# EAGLE schematic smoothieboard-0driver (EAGLE 6.4)

## Sheet 1 of 4
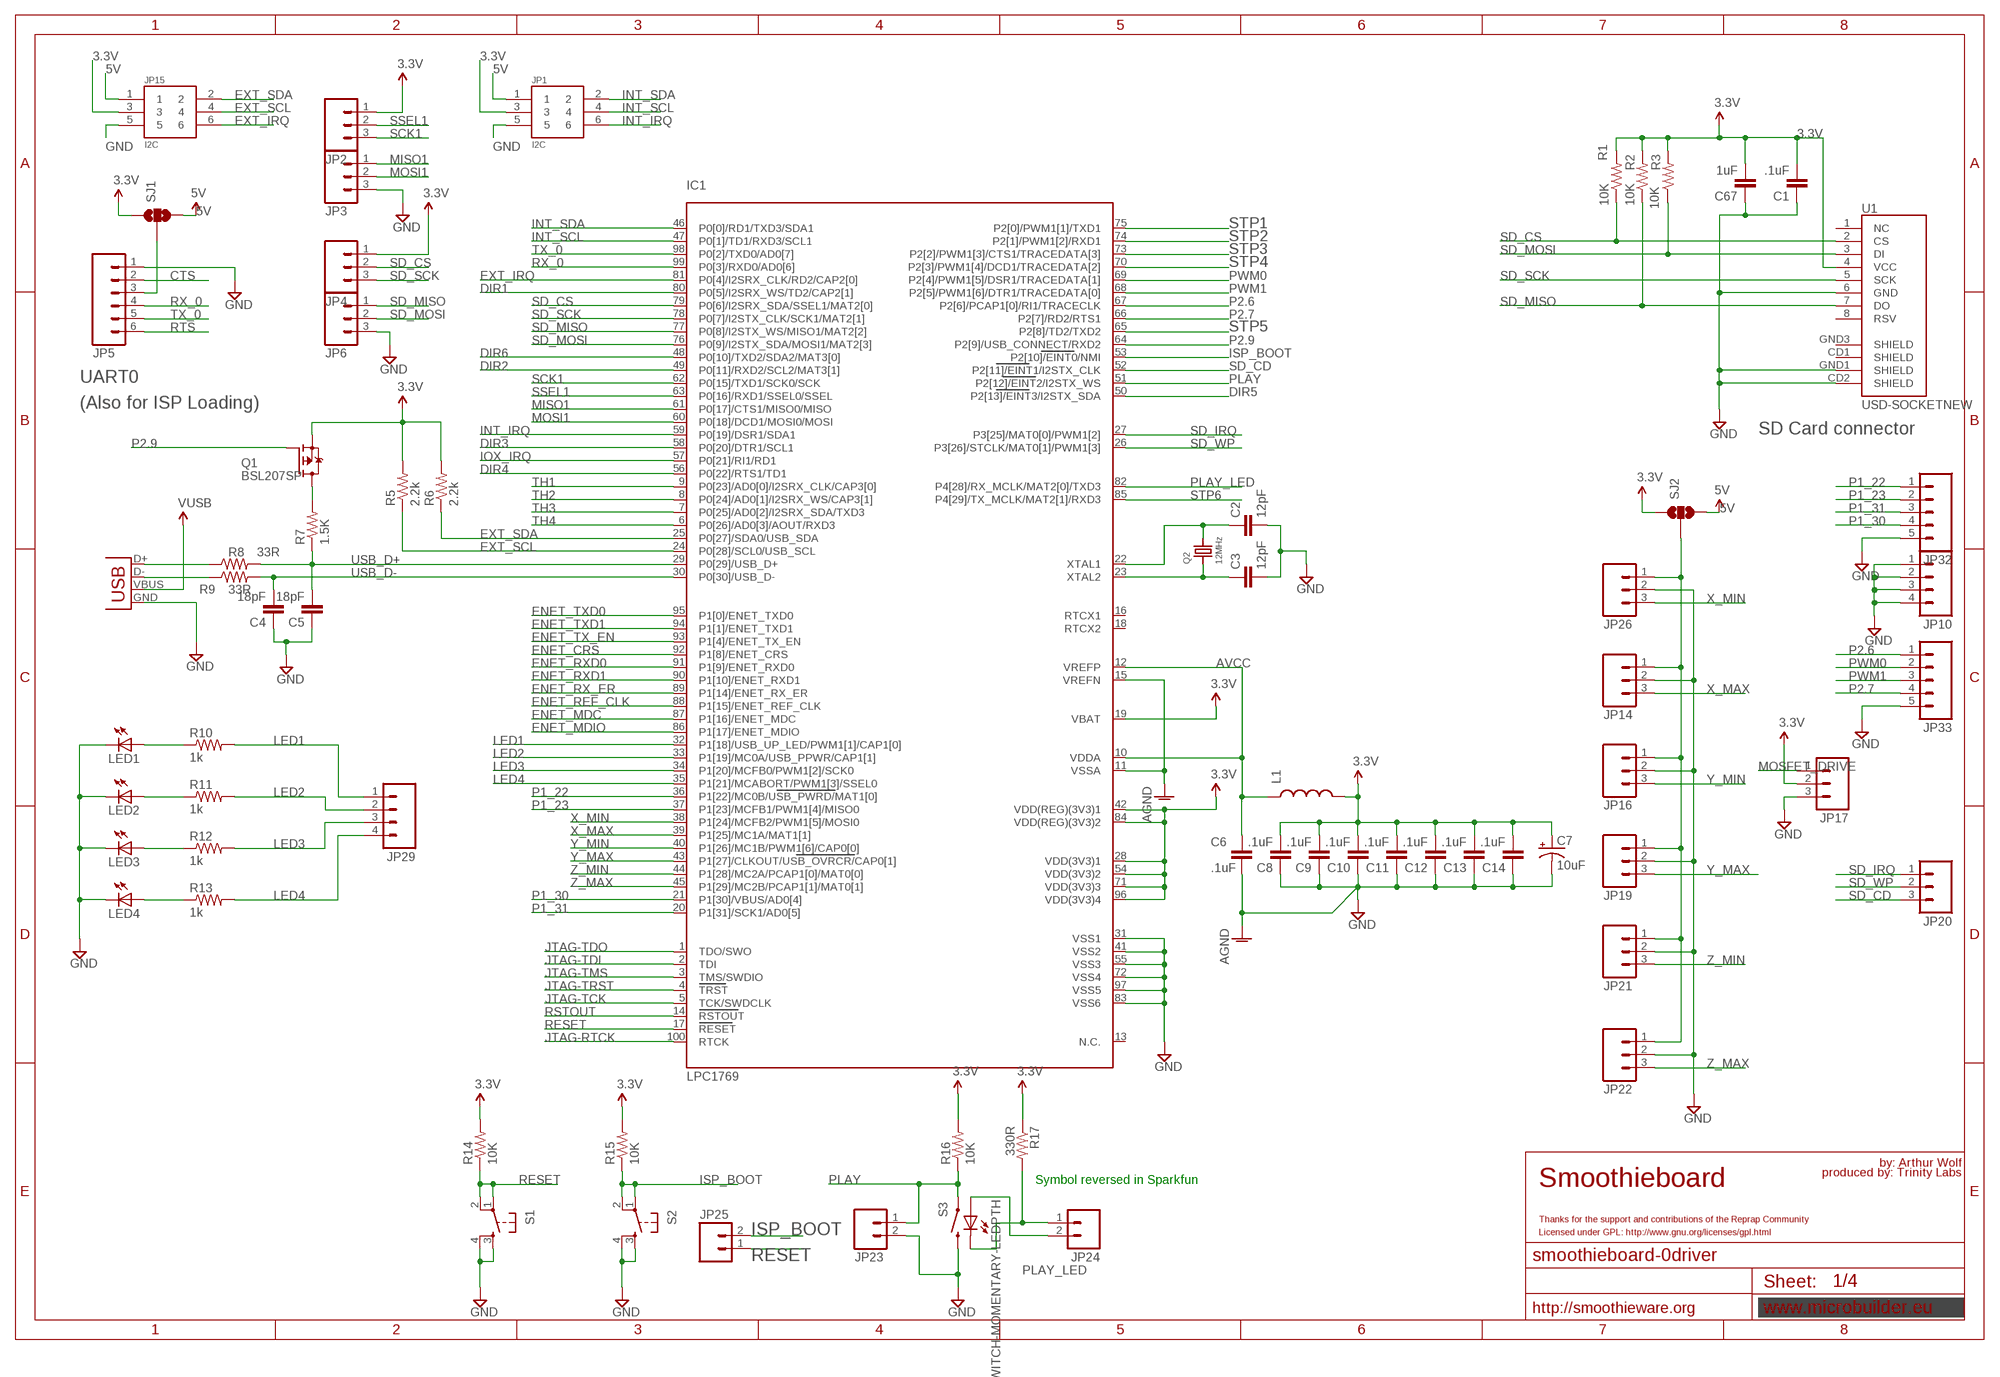
[diagram p0: schematic, sheet 1]

### Parts
C1  .1uF  C-EUC0603  [C0603]
C2  12pF  C-EUC0603  [C0603]
C3  12pF  C-EUC0603  [C0603]
C4  18pF  C-EUC0603  [C0603]
C5  18pF  C-EUC0603  [C0603]
C6  .1uF  C-EUC0603  [C0603]
C7  10uF  CAP_POL1206  [EIA3216]
C8  .1uF  C-EUC0603  [C0603]
C9  .1uF  C-EUC0603  [C0603]
C10  .1uF  C-EUC0603  [C0603]
C11  .1uF  C-EUC0603  [C0603]
C12  .1uF  C-EUC0603  [C0603]
C13  .1uF  C-EUC0603  [C0603]
C14  .1uF  C-EUC0603  [C0603]
C67  1uF  C-EUC0805  [C0805]
IC1  LPC1769  LPC1768  [LQFP100]
JP1  I2C  M03X2  [2X3-SHROUDED]
JP2  M031X03_NO_SILK  [1X03_NO_SILK]
JP3  M031X03_NO_SILK  [1X03_NO_SILK]
JP4  M031X03_NO_SILK  [1X03_NO_SILK]
JP5  M06POLAR  [MOLEX-1X6]
JP6  M031X03_NO_SILK  [1X03_NO_SILK]
JP10  M041X04_NO_SILK  [1X04_NO_SILK]
JP14  M03POLAR  [MOLEX-1X3]
JP15  I2C  M03X2  [2X3-SHROUDED]
JP16  M03POLAR  [MOLEX-1X3]
JP17  M03PTH  [1X03]
JP19  M03POLAR  [MOLEX-1X3]
JP20  M03PTH  [1X03]
JP21  M03POLAR  [MOLEX-1X3]
JP22  M03POLAR  [MOLEX-1X3]
JP23  M02PTH  [1X02]
JP24  M02PTH  [1X02]
JP25  M02PTH  [1X02]
JP26  M03POLAR  [MOLEX-1X3]
JP29  M041X04_NO_SILK  [1X04_NO_SILK]
JP32  M05PTH  [1X05]
JP33  M05PTH  [1X05]
L1  INDUCTOR0603  [0603]
LED1  LEDCHIP-LED0805  [CHIP-LED0805]
LED2  LEDCHIP-LED0805  [CHIP-LED0805]
LED3  LEDCHIP-LED0805  [CHIP-LED0805]
LED4  LEDCHIP-LED0805  [CHIP-LED0805]
Q1  BSL207SP  [SC74_INFINEON]
Q2  12MHz  CRYSTALTHIN  [CRYSTAL_3.2X2.5]
R1  10K  R-US_R0603  [R0603]
R2  10K  R-US_R0603  [R0603]
R3  10K  R-US_R0603  [R0603]
R5  2.2k  R-US_R0603  [R0603]
R6  2.2k  R-US_R0603  [R0603]
R7  1.5K  R-US_R0603  [R0603]
R8  33R  R-US_R0603  [R0603]
R9  33R  R-US_R0603  [R0603]
R10  1k  R-US_R0603  [R0603]
R11  1k  R-US_R0603  [R0603]
R12  1k  R-US_R0603  [R0603]
R13  1k  R-US_R0603  [R0603]
R14  10K  R-US_R0603  [R0603]
R15  10K  R-US_R0603  [R0603]
R16  10K  R-US_R0603  [R0603]
R17  330R  R-US_R0603  [R0603]
S1  TAC_SWITCHSMD  [TACTILE_SWITCH_SMD]
S2  TAC_SWITCHSMD  [TACTILE_SWITCH_SMD]
S3  SWITCH-MOMENTARY-LEDPTH  [TACTILE-PTH-LED-12MM]
SJ1  SOLDERJUMPER_2WAYS  [SJ_3]
SJ2  SOLDERJUMPER_2WAYS  [SJ_3]
U1  USD-SOCKETNEW  [MICRO-SD-SOCKET-PP]
X14  USBPTH  [USB-B-PTH]

### Nets
3.3V: C1.2 C7.A(+) C8.2 C9.2 C10.2 C11.2 C12.2 C13.2 C14.2 C67.2 IC1.19(VBAT) IC1.28(VDD(3V3)1) IC1.42(VDD(REG)(3V3)1) IC1.54(VDD(3V3)2) IC1.71(VDD(3V3)3) IC1.84(VDD(REG)(3V3)2) IC1.96(VDD(3V3)4) JP1.3 JP2.1 JP4.1 JP15.3 JP17.2 L1.2 Q1.4(S) R1.2 R2.2 R3.2 R5.2 R6.2 R14.2 R15.2 R16.2 R17.1 SJ1.1 SJ2.1 U1.4(VCC) ; also sheet 2,3
5V: JP1.1 JP15.1 SJ1.3 SJ2.3 ; also sheet 2,3,4
AGND: C6.2 IC1.11(VSSA) IC1.15(VREFN) ; also sheet 2
AVCC: C6.1 IC1.10(VDDA) IC1.12(VREFP) L1.1 ; also sheet 2
CTS: JP5.2
DIR1: IC1.80(P0[5]/I2SRX_WS/TD2/CAP2[1]) ; also sheet 2
DIR2: IC1.49(P0[11]/RXD2/SCL2/MAT3[1]) ; also sheet 2
DIR3: IC1.58(P0[20]/DTR1/SCL1) ; also sheet 2
DIR4: IC1.56(P0[22]/RTS1/TD1) ; also sheet 2
DIR5: IC1.50(P2[13]/EINT3/I2STX_SDA) ; also sheet 2
DIR6: IC1.48(P0[10]/TXD2/SDA2/MAT3[0]) ; also sheet 2
ENET_CRS: IC1.92(P1[8]/ENET_CRS) ; also sheet 3
ENET_MDC: IC1.87(P1[16]/ENET_MDC) ; also sheet 3
ENET_MDIO: IC1.86(P1[17]/ENET_MDIO) ; also sheet 3
ENET_REF_CLK: IC1.88(P1[15]/ENET_REF_CLK) ; also sheet 3
ENET_RX_ER: IC1.89(P1[14]/ENET_RX_ER) ; also sheet 3
ENET_RXD0: IC1.91(P1[9]/ENET_RXD0) ; also sheet 3
ENET_RXD1: IC1.90(P1[10]/ENET_RXD1) ; also sheet 3
ENET_TX_EN: IC1.93(P1[4]/ENET_TX_EN) ; also sheet 3
ENET_TXD0: IC1.95(P1[0]/ENET_TXD0) ; also sheet 3
ENET_TXD1: IC1.94(P1[1]/ENET_TXD1) ; also sheet 3
EXT_IRQ: IC1.81(P0[4]/I2SRX_CLK/RD2/CAP2[0]) JP15.6
EXT_SCL: IC1.24(P0[28]/SCL0/USB_SCL) JP15.4 R5.1
EXT_SDA: IC1.25(P0[27]/SDA0/USB_SDA) JP15.2 R6.1
GND: C1.1 C2.2 C3.2 C4.1 C5.1 C7.C(-) C8.1 C9.1 C10.1 C11.1 C12.1 C13.1 C14.1 C67.1 IC1.31(VSS1) IC1.41(VSS2) IC1.55(VSS3) IC1.72(VSS4) IC1.83(VSS6) IC1.97(VSS5) JP1.5 JP3.3 JP5.1 JP6.3 JP10.1 JP10.2 JP10.3 JP10.4 JP14.2 JP15.5 JP16.2 JP17.3 JP19.2 JP21.2 JP22.2 JP23.2 JP26.2 JP32.5 JP33.5 LED1.C LED2.C LED3.C LED4.C S1.3 S1.4 S2.3 S2.4 S3.2 U1.6(GND) U1.CD2(SHIELD) U1.GND1(SHIELD) X14.GND ; also sheet 2,3,4
INT_IRQ: IC1.59(P0[19]/DSR1/SDA1) JP1.6
INT_SCL: IC1.47(P0[1]/TD1/RXD3/SCL1) JP1.4 ; also sheet 2
INT_SDA: IC1.46(P0[0]/RD1/TXD3/SDA1) JP1.2 ; also sheet 2
IOX_IRQ: IC1.57(P0[21]/RI1/RD1) ; also sheet 2
ISP_BOOT: IC1.53(P2[10]/EINT0/NMI) JP25.2 R15.1 S2.1 S2.2
JTAG-RTCK: IC1.100(RTCK)
JTAG-TCK: IC1.5(TCK/SWDCLK)
JTAG-TDI: IC1.2(TDI)
JTAG-TDO: IC1.1(TDO/SWO)
JTAG-TMS: IC1.3(TMS/SWDIO)
JTAG-TRST: IC1.4(TRST)
LED1: IC1.32(P1[18]/USB_UP_LED/PWM1[1]/CAP1[0]) JP29.1 R10.2
LED2: IC1.33(P1[19]/MC0A/USB_PPWR/CAP1[1]) JP29.2 R11.2
LED3: IC1.34(P1[20]/MCFB0/PWM1[2]/SCK0) JP29.3 R12.2
LED4: IC1.35(P1[21]/MCABORT/PWM1[3]/SSEL0) JP29.4 R13.2
MISO1: IC1.61(P0[17]/CTS1/MISO0/MISO) JP3.1
MOSFET_DRIVE: JP17.1 ; also sheet 3,4
MOSI1: IC1.60(P0[18]/DCD1/MOSI0/MOSI) JP3.2
N$1: C2.1 IC1.22(XTAL1) Q2.2
N$2: C3.1 IC1.23(XTAL2) Q2.1
N$23: JP5.3 SJ1.2
N$51: Q1.1(D) Q1.2(D) Q1.5(D) Q1.6(D) R7.2
N$61: R8.1 X14.D+
N$62: R9.1 X14.D-
N$73: JP24.1 R17.2 S3.C
N$84: LED4.A R13.1
N$85: LED3.A R12.1
N$86: LED2.A R11.1
N$87: LED1.A R10.1
N$115: JP14.1 JP16.1 JP19.1 JP21.1 JP22.1 JP26.1 SJ2.2
P1_22: IC1.36(P1[22]/MC0B/USB_PWRD/MAT1[0]) JP32.1 ; also sheet 4
P1_23: IC1.37(P1[23]/MCFB1/PWM1[4]/MISO0) JP32.2 ; also sheet 4
P1_30: IC1.21(P1[30]/VBUS/AD0[4]) JP32.4
P1_31: IC1.20(P1[31]/SCK1/AD0[5]) JP32.3
P2.6: IC1.67(P2[6]/PCAP1[0]/RI1/TRACECLK) JP33.1 ; also sheet 3
P2.7: IC1.66(P2[7]/RD2/RTS1) JP33.4 ; also sheet 3
P2.9: IC1.64(P2[9]/USB_CONNECT/RXD2) Q1.3(G)
PLAY: IC1.51(P2[12]/EINT2/I2STX_WS) JP23.1 R16.1 S3.4
PLAY_LED: IC1.82(P4[28]/RX_MCLK/MAT2[0]/TXD3) JP24.2 S3.A
PWM0: IC1.69(P2[4]/PWM1[5]/DSR1/TRACEDATA[1]) JP33.2 ; also sheet 3
PWM1: IC1.68(P2[5]/PWM1[6]/DTR1/TRACEDATA[0]) JP33.3 ; also sheet 3
RESET: IC1.17(RESET) JP25.1 R14.1 S1.1 S1.2 ; also sheet 2
RSTOUT: IC1.14(RSTOUT) ; also sheet 3
RTS: JP5.6
RX_0: IC1.99(P0[3]/RXD0/AD0[6]) JP5.4
SCK1: IC1.62(P0[15]/TXD1/SCK0/SCK) JP2.3
SD_CD: IC1.52(P2[11]/EINT1/I2STX_CLK) JP20.3
SD_CS: IC1.79(P0[6]/I2SRX_SDA/SSEL1/MAT2[0]) JP4.2 R1.1 U1.2(CS)
SD_IRQ: IC1.27(P3[25]/MAT0[0]/PWM1[2]) JP20.1
SD_MISO: IC1.77(P0[8]/I2STX_WS/MISO1/MAT2[2]) JP6.1 R2.1 U1.7(DO)
SD_MOSI: IC1.76(P0[9]/I2STX_SDA/MOSI1/MAT2[3]) JP6.2 R3.1 U1.3(DI)
SD_SCK: IC1.78(P0[7]/I2STX_CLK/SCK1/MAT2[1]) JP4.3 U1.5(SCK)
SD_WP: IC1.26(P3[26]/STCLK/MAT0[1]/PWM1[3]) JP20.2
SSEL1: IC1.63(P0[16]/RXD1/SSEL0/SSEL) JP2.2
STP1: IC1.75(P2[0]/PWM1[1]/TXD1) ; also sheet 2
STP2: IC1.74(P2[1]/PWM1[2]/RXD1) ; also sheet 2
STP3: IC1.73(P2[2]/PWM1[3]/CTS1/TRACEDATA[3]) ; also sheet 2
STP4: IC1.70(P2[3]/PWM1[4]/DCD1/TRACEDATA[2]) ; also sheet 2
STP5: IC1.65(P2[8]/TD2/TXD2) ; also sheet 2
STP6: IC1.85(P4[29]/TX_MCLK/MAT2[1]/RXD3) ; also sheet 2
TH1: IC1.9(P0[23]/AD0[0]/I2SRX_CLK/CAP3[0]) ; also sheet 2
TH2: IC1.8(P0[24]/AD0[1]/I2SRX_WS/CAP3[1]) ; also sheet 2
TH3: IC1.7(P0[25]/AD0[2]/I2SRX_SDA/TXD3) ; also sheet 2
TH4: IC1.6(P0[26]/AD0[3]/AOUT/RXD3) ; also sheet 2
TX_0: IC1.98(P0[2]/TXD0/AD0[7]) JP5.5
USB_D+: C5.2 IC1.29(P0[29]/USB_D+) R7.1 R8.2
USB_D-: C4.2 IC1.30(P0[30]/USB_D-) R9.2
VUSB: X14.VBUS ; also sheet 3
X_MAX: IC1.39(P1[25]/MC1A/MAT1[1]) JP14.3
X_MIN: IC1.38(P1[24]/MCFB2/PWM1[5]/MOSI0) JP26.3
Y_MAX: IC1.43(P1[27]/CLKOUT/USB_OVRCR/CAP0[1]) JP19.3
Y_MIN: IC1.40(P1[26]/MC1B/PWM1[6]/CAP0[0]) JP16.3
Z_MAX: IC1.45(P1[29]/MC2B/PCAP1[1]/MAT0[1]) JP22.3
Z_MIN: IC1.44(P1[28]/MC2A/PCAP1[0]/MAT0[0]) JP21.3
Unconnected: IC1.13(N.C.) IC1.16(RTCX1) IC1.18(RTCX2) U1.1(NC) U1.8(RSV) U1.CD1(SHIELD) U1.GND3(SHIELD)

### Notes on the sheet
- UART0
- (Also for ISP Loading)
- SD Card connector
- by: Arthur Wolf
- produced by: Trinity Labs
- Symbol reversed in Sparkfun | Smoothieboard
- Thanks for the support and contributions of the Reprap Community
- Licensed under GPL: http://www.gnu.org/licenses/gpl.html
- http://smoothieware.org

## Sheet 2 of 4
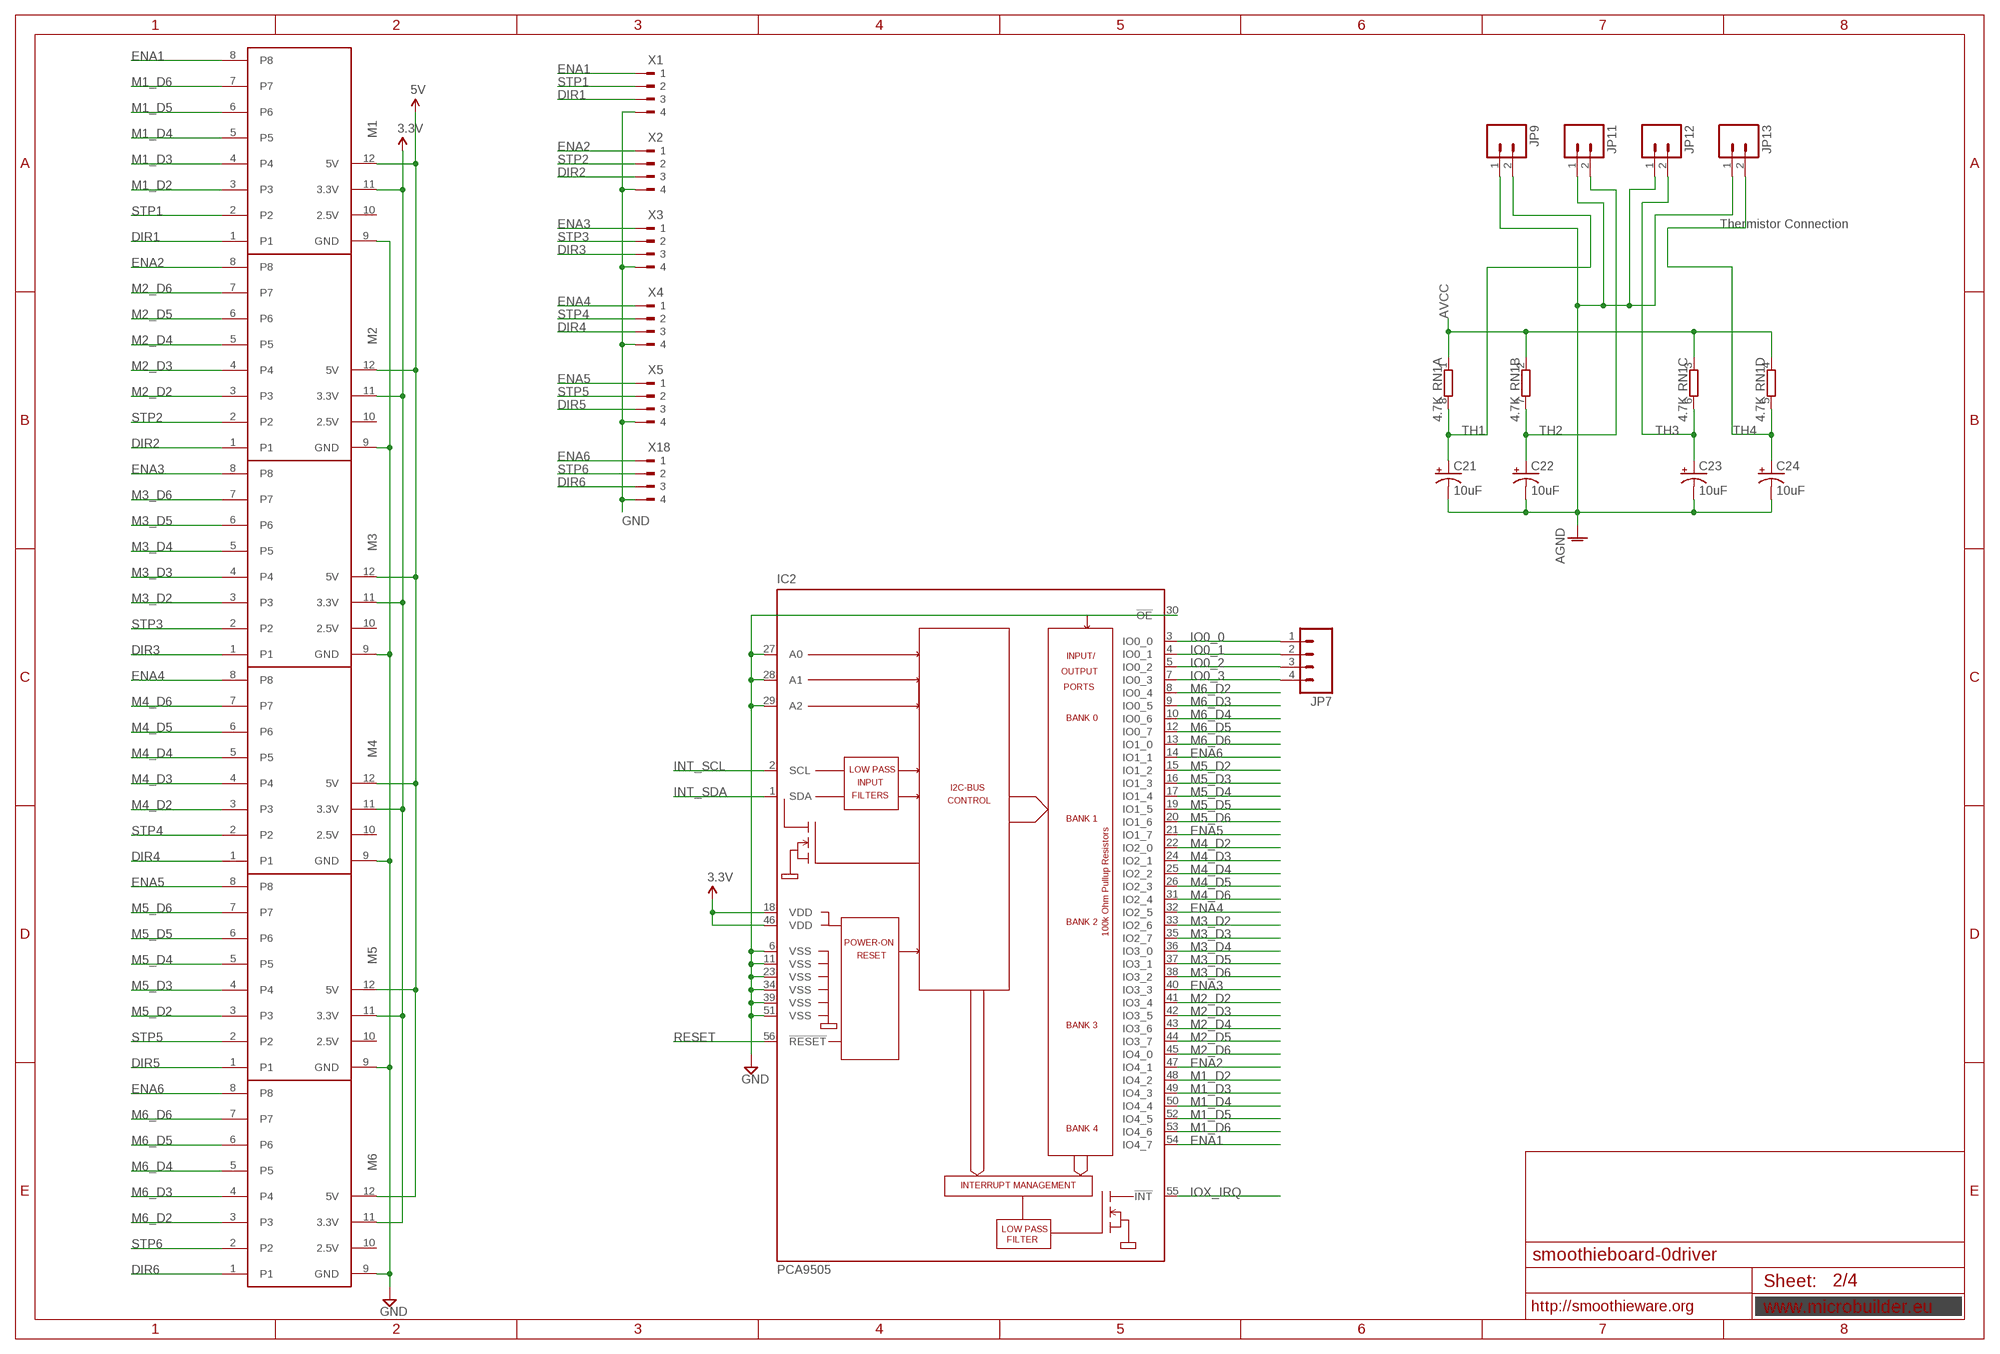
[diagram p1: schematic, sheet 2]

### Parts
C21  10uF  CAP_POL1206  [EIA3216]
C22  10uF  CAP_POL1206  [EIA3216]
C23  10uF  CAP_POL1206  [EIA3216]
C24  10uF  CAP_POL1206  [EIA3216]
IC2  PCA9505  [TSSOP56-6]
JP7  M04PTH  [1X04]
JP9  M02POLAR  [MOLEX-1X2]
JP11  M02POLAR  [MOLEX-1X2]
JP12  M02POLAR  [MOLEX-1X2]
JP13  M02POLAR  [MOLEX-1X2]
M1  PAPILIO-WING-8BIT  [PAPILIO-WING-8BIT]
M2  PAPILIO-WING-8BIT  [PAPILIO-WING-8BIT]
M3  PAPILIO-WING-8BIT  [PAPILIO-WING-8BIT]
M4  PAPILIO-WING-8BIT  [PAPILIO-WING-8BIT]
M5  PAPILIO-WING-8BIT  [PAPILIO-WING-8BIT]
M6  PAPILIO-WING-8BIT  [PAPILIO-WING-8BIT]
RN1  4.7K  4R-N0603-ARV  [0603-ARV]
X1  180-4  [180-4]
X2  180-4  [180-4]
X3  180-4  [180-4]
X4  180-4  [180-4]
X5  180-4  [180-4]
X18  180-4  [180-4]

### Nets
3.3V: IC2.18(VDD) IC2.46(VDD) M1.11(3.3V) M2.11(3.3V) M3.11(3.3V) M4.11(3.3V) M5.11(3.3V) M6.11(3.3V) ; also sheet 1,3
5V: M1.12(5V) M2.12(5V) M3.12(5V) M4.12(5V) M5.12(5V) M6.12(5V) ; also sheet 1,3,4
AGND: C21.C(-) C22.C(-) C23.C(-) C24.C(-) JP9.1 JP11.1 JP12.1 JP13.1 ; also sheet 1
AVCC: RN1.1 RN1.2 RN1.3 RN1.4 ; also sheet 1
DIR1: M1.1 X1.3 ; also sheet 1
DIR2: M2.1 X2.3 ; also sheet 1
DIR3: M3.1 X3.3 ; also sheet 1
DIR4: M4.1 X4.3 ; also sheet 1
DIR5: M5.1 X5.3 ; also sheet 1
DIR6: M6.1 X18.3 ; also sheet 1
ENA1: IC2.54(IO4_7) M1.8 X1.1
ENA2: IC2.47(IO4_1) M2.8 X2.1
ENA3: IC2.40(IO3_3) M3.8 X3.1
ENA4: IC2.32(IO2_5) M4.8 X4.1
ENA5: IC2.21(IO1_7) M5.8 X5.1
ENA6: IC2.14(IO1_1) M6.8 X18.1
GND: IC2.6(VSS) IC2.11(VSS) IC2.23(VSS) IC2.27(A0) IC2.28(A1) IC2.29(A2) IC2.30(!OE) IC2.34(VSS) IC2.39(VSS) IC2.51(VSS) M1.9(GND) M2.9(GND) M3.9(GND) M4.9(GND) M5.9(GND) M6.9(GND) X1.4 X2.4 X3.4 X4.4 X5.4 X18.4 ; also sheet 1,3,4
INT_SCL: IC2.2(SCL) ; also sheet 1
INT_SDA: IC2.1(SDA) ; also sheet 1
IO0_0: IC2.3(IO0_0) JP7.1
IO0_1: IC2.4(IO0_1) JP7.2
IO0_2: IC2.5(IO0_2) JP7.3
IO0_3: IC2.7(IO0_3) JP7.4
IOX_IRQ: IC2.55(!INT) ; also sheet 1
M1_D2: IC2.48(IO4_2) M1.3
M1_D3: IC2.49(IO4_3) M1.4
M1_D4: IC2.50(IO4_4) M1.5
M1_D5: IC2.52(IO4_5) M1.6
M1_D6: IC2.53(IO4_6) M1.7
M2_D2: IC2.41(IO3_4) M2.3
M2_D3: IC2.42(IO3_5) M2.4
M2_D4: IC2.43(IO3_6) M2.5
M2_D5: IC2.44(IO3_7) M2.6
M2_D6: IC2.45(IO4_0) M2.7
M3_D2: IC2.33(IO2_6) M3.3
M3_D3: IC2.35(IO2_7) M3.4
M3_D4: IC2.36(IO3_0) M3.5
M3_D5: IC2.37(IO3_1) M3.6
M3_D6: IC2.38(IO3_2) M3.7
M4_D2: IC2.22(IO2_0) M4.3
M4_D3: IC2.24(IO2_1) M4.4
M4_D4: IC2.25(IO2_2) M4.5
M4_D5: IC2.26(IO2_3) M4.6
M4_D6: IC2.31(IO2_4) M4.7
M5_D2: IC2.15(IO1_2) M5.3
M5_D3: IC2.16(IO1_3) M5.4
M5_D4: IC2.17(IO1_4) M5.5
M5_D5: IC2.19(IO1_5) M5.6
M5_D6: IC2.20(IO1_6) M5.7
M6_D2: IC2.8(IO0_4) M6.3
M6_D3: IC2.9(IO0_5) M6.4
M6_D4: IC2.10(IO0_6) M6.5
M6_D5: IC2.12(IO0_7) M6.6
M6_D6: IC2.13(IO1_0) M6.7
RESET: IC2.56(!RESET) ; also sheet 1
STP1: M1.2 X1.2 ; also sheet 1
STP2: M2.2 X2.2 ; also sheet 1
STP3: M3.2 X3.2 ; also sheet 1
STP4: M4.2 X4.2 ; also sheet 1
STP5: M5.2 X5.2 ; also sheet 1
STP6: M6.2 X18.2 ; also sheet 1
TH1: C21.A(+) JP9.2 RN1.8 ; also sheet 1
TH2: C22.A(+) JP11.2 RN1.7 ; also sheet 1
TH3: C23.A(+) JP12.2 RN1.6 ; also sheet 1
TH4: C24.A(+) JP13.2 RN1.5 ; also sheet 1
Unconnected: M1.10(2.5V) M2.10(2.5V) M3.10(2.5V) M4.10(2.5V) M5.10(2.5V) M6.10(2.5V)

### Notes on the sheet
- Thermistor Connection
- http://smoothieware.org

## Sheet 3 of 4
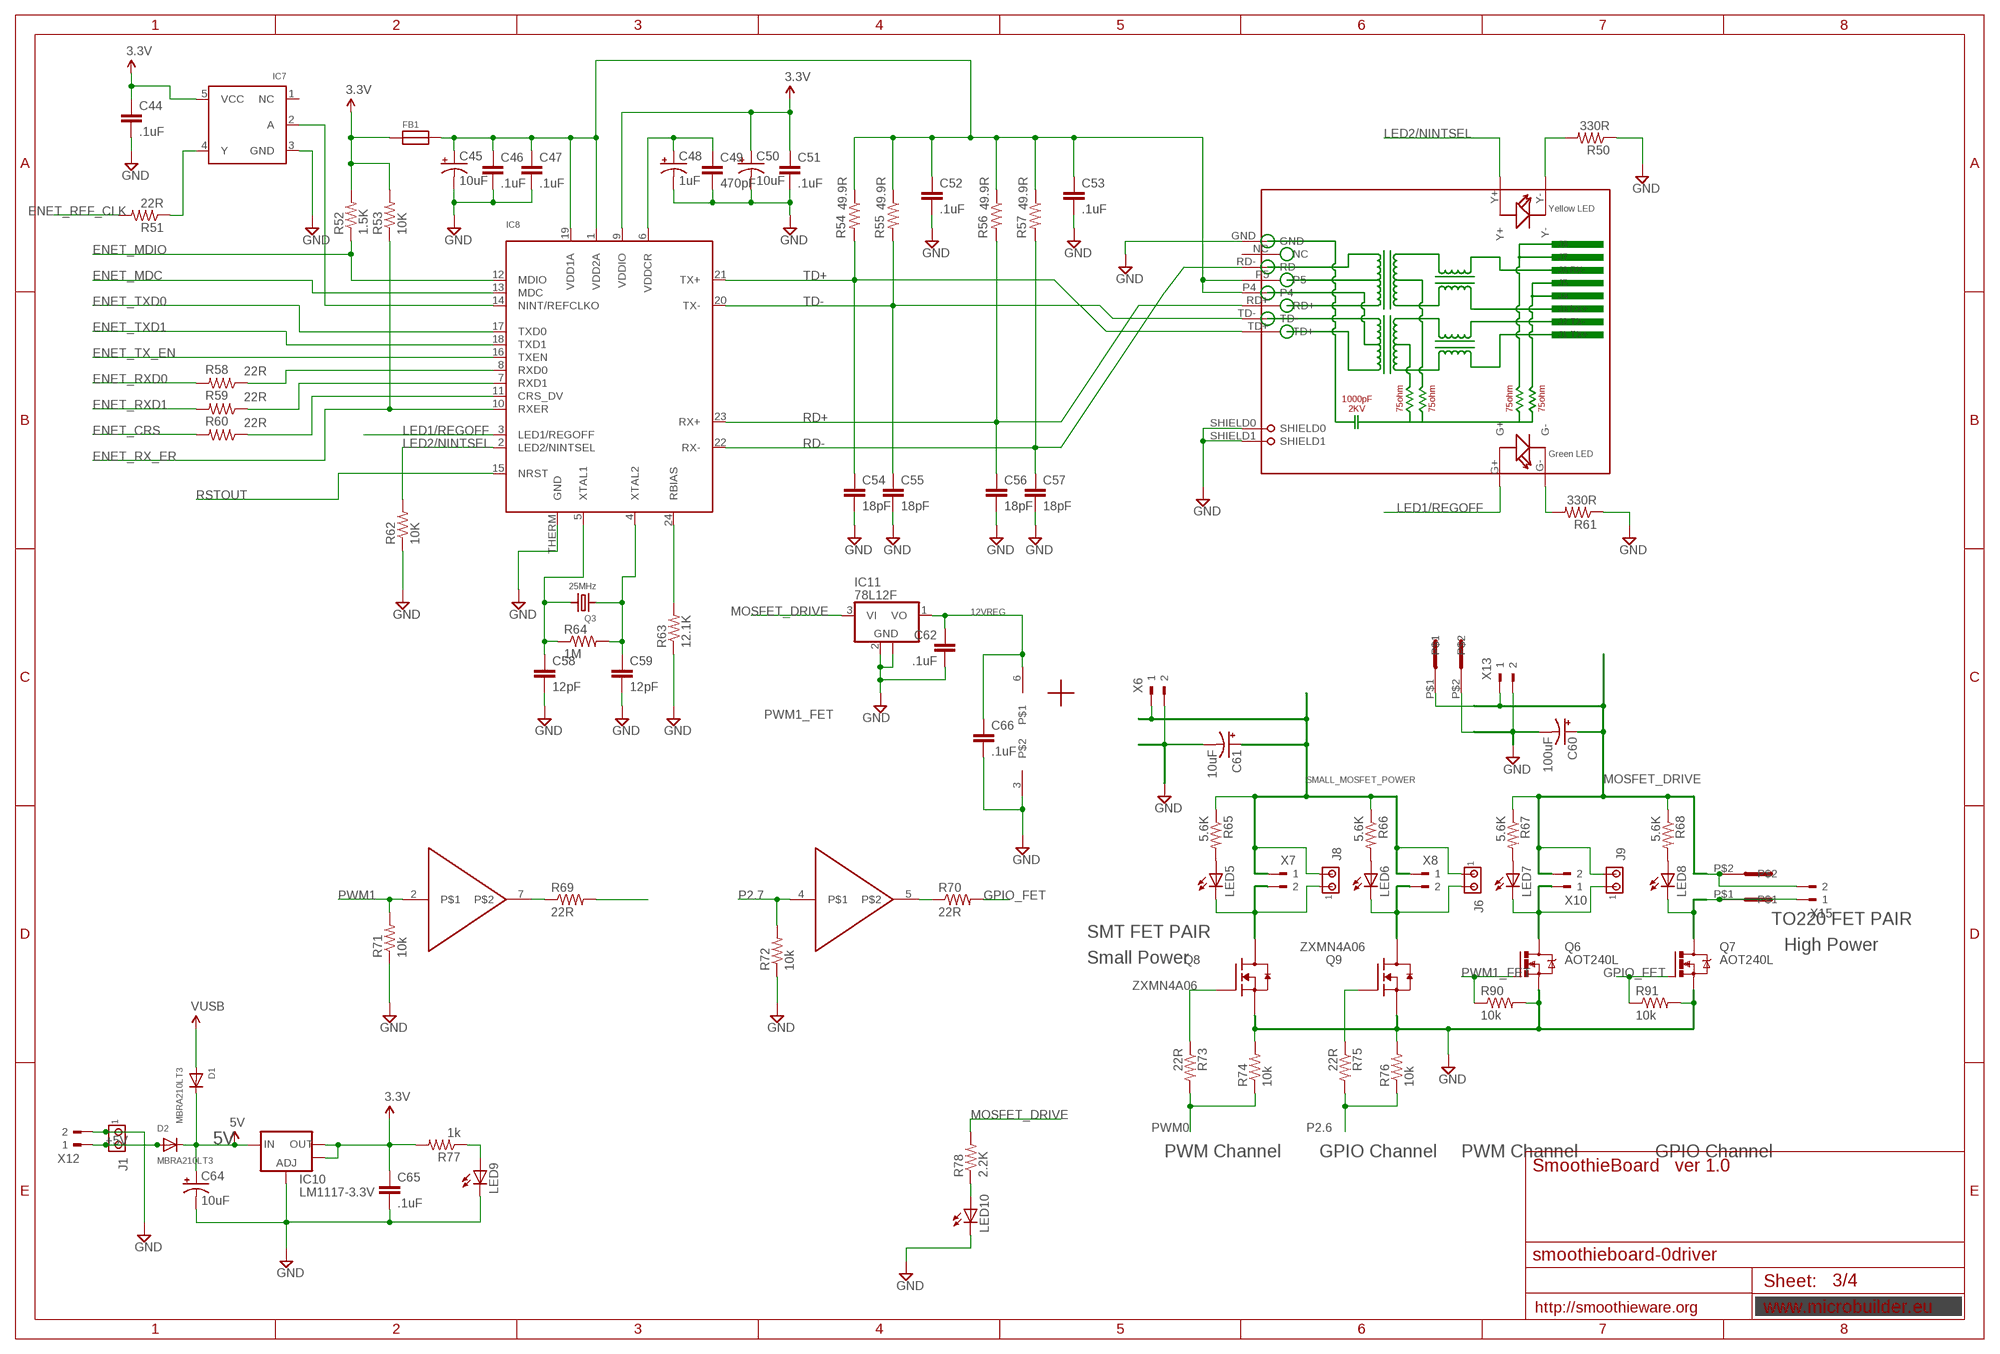
[diagram p2: schematic, sheet 3]

### Parts
C44  .1uF  C-EUC0603  [C0603]
C45  10uF  CAP_POL1206  [EIA3216]
C46  .1uF  C-EUC0603  [C0603]
C47  .1uF  C-EUC0603  [C0603]
C48  1uF  CAP_POL1206  [EIA3216]
C49  470pF  C-EUC0603K  [C0603K]
C50  10uF  CAP_POL1206  [EIA3216]
C51  .1uF  C-EUC0603  [C0603]
C52  .1uF  C-EUC0603  [C0603]
C53  .1uF  C-EUC0603  [C0603]
C54  18pF  C-EUC0603  [C0603]
C55  18pF  C-EUC0603  [C0603]
C56  18pF  C-EUC0603  [C0603]
C57  18pF  C-EUC0603  [C0603]
C58  12pF  C-EUC0603  [C0603]
C59  12pF  C-EUC0603  [C0603]
C60  100uF  CAP_POLE  [PANASONIC_E]
C61  10uF  CAP_POL1206  [EIA3216]
C62  .1uF  C-EUC0603  [C0603]
C64  10uF  CAP_POL1206  [EIA3216]
C65  .1uF  C-EUC0603  [C0603]
C66  .1uF  C-EUC0603  [C0603]
D1  MBRA210LT3  DIODESMA  [SMADIODE]
D2  MBRA210LT3  DIODESMA  [SMADIODE]
FB1  FERRITE  [0603]
IC7  74LVC1G04  [SOT23-5]
IC8  LAN8720  [QFN24_4MM]
IC10  LM1117-3.3V  V_REG_LM1117SOT223  [SOT223]
IC11  78L12F  [SOT89]
J1  MTA02-100  [10X02MTA]
J6  MTA02-100  [10X02MTA]
J8  MTA02-100  [10X02MTA]
J9  MTA02-100  [10X02MTA]
LED5  LEDCHIP-LED0805  [CHIP-LED0805]
LED6  LEDCHIP-LED0805  [CHIP-LED0805]
LED7  LEDCHIP-LED0805  [CHIP-LED0805]
LED8  LEDCHIP-LED0805  [CHIP-LED0805]
LED9  LEDCHIP-LED0805  [CHIP-LED0805]
LED10  LEDCHIP-LED0805  [CHIP-LED0805]
Q3  25MHz  CRYSTALTHIN  [CRYSTAL_3.2X2.5]
Q6  AOT240L  IRF540  [TO220BV]
Q7  AOT240L  IRF540  [TO220BV]
Q8  ZXMN4A06  MOSFET-NCH_SOT-223  [SOT230P700X160-4N]
Q9  ZXMN4A06  MOSFET-NCH_SOT-223  [SOT230P700X160-4N]
R50  330R  R-US_R0603  [R0603]
R51  22R  R-US_R0603  [R0603]
R52  1.5K  R-US_R0603  [R0603]
R53  10K  R-US_R0603  [R0603]
R54  49.9R  R-US_R0603  [R0603]
R55  49.9R  R-US_R0603  [R0603]
R56  49.9R  R-US_R0603  [R0603]
R57  49.9R  R-US_R0603  [R0603]
R58  22R  R-US_R0603  [R0603]
R59  22R  R-US_R0603  [R0603]
R60  22R  R-US_R0603  [R0603]
R61  330R  R-US_R0603  [R0603]
R62  10K  R-US_R0603  [R0603]
R63  12.1K  R-US_R0603  [R0603]
R64  1M  R-US_R0603  [R0603]
R65  5.6K  R-US_R0603  [R0603]
R66  5.6K  R-US_R0603  [R0603]
R67  5.6K  R-US_R0603  [R0603]
R68  5.6K  R-US_R0603  [R0603]
R69  22R  R-US_R0603  [R0603]
R70  22R  R-US_R0603  [R0603]
R71  10k  R-US_R0603  [R0603]
R72  10k  R-US_R0603  [R0603]
R73  22R  R-US_R0603  [R0603]
R74  10k  R-US_R0603  [R0603]
R75  22R  R-US_R0603  [R0603]
R76  10k  R-US_R0603  [R0603]
R77  1k  R-US_R0603  [R0603]
R78  2.2K  R-US_R0603  [R0603]
R90  10k  R-US_R0603  [R0603]
R91  10k  R-US_R0603  [R0603]
RJ1  HR911105A  [HR911105A]
U$2  TC4427  [SOIC8]
U$5  5MMCONN  [1715250000]
U$6  5MMCONN  [1715250000]
X6  180G-2  [180G-2]
X7  180G-2  [180G-2]
X8  180G-2  [180G-2]
X10  180G-2  [180G-2]
X12  180G-2  [180G-2]
X13  180G-2  [180G-2]
X15  180G-2  [180G-2]

### Nets
3.3V: C44.1 C50.A(+) C51.1 C65.1 FB1.1 IC7.5(VCC) IC8.9(VDDIO) IC10.2(OUT) IC10.4(OUT) R52.2 R53.2 R77.2 ; also sheet 1,2
5V: C64.A(+) D1.C D2.C IC10.3(IN) ; also sheet 1,2,4
12VREG: C62.1 C66.1 IC11.1(VO) U$2.6 ; also sheet 4
+5V: D2.A J1.2 X12.1
ENET_CRS: R60.2 ; also sheet 1
ENET_MDC: IC8.13(MDC) ; also sheet 1
ENET_MDIO: IC8.12(MDIO) R52.1 ; also sheet 1
ENET_REF_CLK: R51.2 ; also sheet 1
ENET_RX_ER: IC8.10(RXER) R53.1 ; also sheet 1
ENET_RXD0: R58.2 ; also sheet 1
ENET_RXD1: R59.2 ; also sheet 1
ENET_TX_EN: IC8.16(TXEN) ; also sheet 1
ENET_TXD0: IC8.17(TXD0) ; also sheet 1
ENET_TXD1: IC8.18(TXD1) ; also sheet 1
GND: C44.2 C45.C(-) C46.2 C47.2 C48.C(-) C49.2 C50.C(-) C51.2 C52.2 C53.2 C54.2 C55.2 C56.2 C57.2 C58.2 C59.2 C60.- C61.C(-) C62.2 C64.C(-) C65.2 C66.2 IC7.3(GND) IC8.THERM(GND) IC10.1(ADJ) IC11.2(GND) IC11.2@1(GND) J1.1 LED9.C LED10.C Q6.S Q7.S Q8.3(S) Q9.3(S) R50.1 R61.1 R62.1 R63.1 R71.1 R72.1 R74.2 R76.2 R90.2 R91.2 RJ1.GND RJ1.SHIELD0 RJ1.SHIELD1 U$2.3 U$5.P$2 X6.2 X12.2 X13.2 ; also sheet 1,2,4
GPIO_FET: Q7.G R70.2 R91.1
LED1/REGOFF: IC8.3(LED1/REGOFF) RJ1.G+
LED2/NINTSEL: IC8.2(LED2/NINTSEL) R62.2 RJ1.Y+
MOSFET_DRIVE: C60.+ IC11.3(VI) J9.2 R67.1 R68.1 R78.2 U$5.P$1 U$6.P$2 X10.2 X13.1 X15.2 ; also sheet 1,4
N$5: R69.1 U$2.7
N$16: LED10.A R78.1
N$18: J6.2 LED6.C Q9.4(D) X8.2
N$19: R70.1 U$2.5
N$20: R61.2 RJ1.G-
N$21: C45.A(+) C46.1 C47.1 C52.1 C53.1 FB1.2 IC8.1(VDD2A) IC8.19(VDD1A) R54.1 R55.1 R56.1 R57.1 RJ1.P4 RJ1.P5
N$42: IC8.8(RXD0) R58.1
N$47: R50.2 RJ1.Y-
N$55: IC8.7(RXD1) R59.1
N$63: IC8.11(CRS_DV) R60.1
N$67: C59.1 IC8.4(XTAL2) Q3.1 R64.2
N$68: C58.1 IC8.5(XTAL1) Q3.2 R64.1
N$69: IC8.24(RBIAS) R63.2
N$74: Q8.1(G) R73.1
N$75: Q9.1(G) R75.1
N$77: IC7.2(A) IC8.14(NINT/REFCLKO)
N$78: IC7.4(Y) R51.1
N$80: LED9.A R77.1
N$81: LED5.A R65.2
N$82: C48.A(+) C49.1 IC8.6(VDDCR)
N$88: J8.1 LED5.C Q8.4(D) X7.2
N$91: LED6.A R66.2
N$92: J9.1 LED7.C Q6.D X10.1
N$94: LED8.C Q7.D U$6.P$1 X15.1
N$105: LED7.A R67.2
N$112: LED8.A R68.2
P2.6: R75.2 R76.1 ; also sheet 1
P2.7: R72.2 U$2.4 ; also sheet 1
PWM0: R73.2 R74.1 ; also sheet 1
PWM1: R71.2 U$2.2 ; also sheet 1
PWM1_FET: Q6.G R69.2 R90.1
RD+: C56.1 IC8.23(RX+) R56.2 RJ1.RD+
RD-: C57.1 IC8.22(RX-) R57.2 RJ1.RD-
RSTOUT: IC8.15(NRST) ; also sheet 1
SMALL_MOSFET_POWER: C61.A(+) J6.1 J8.2 R65.1 R66.1 X6.1 X7.1 X8.1
TD+: C54.1 IC8.21(TX+) R54.2 RJ1.TD+
TD-: C55.1 IC8.20(TX-) R55.2 RJ1.TD-
VUSB: D1.A ; also sheet 1
Unconnected: IC7.1(NC) RJ1.NC

### Notes on the sheet
- TO220 FET PAIR
- SMT FET PAIR
- High Power
- Small Power
- PWM Channel | GPIO Channel | PWM Channel | GPIO Channel
- SmoothieBoard   ver 1.0
- http://smoothieware.org

## Sheet 4 of 4
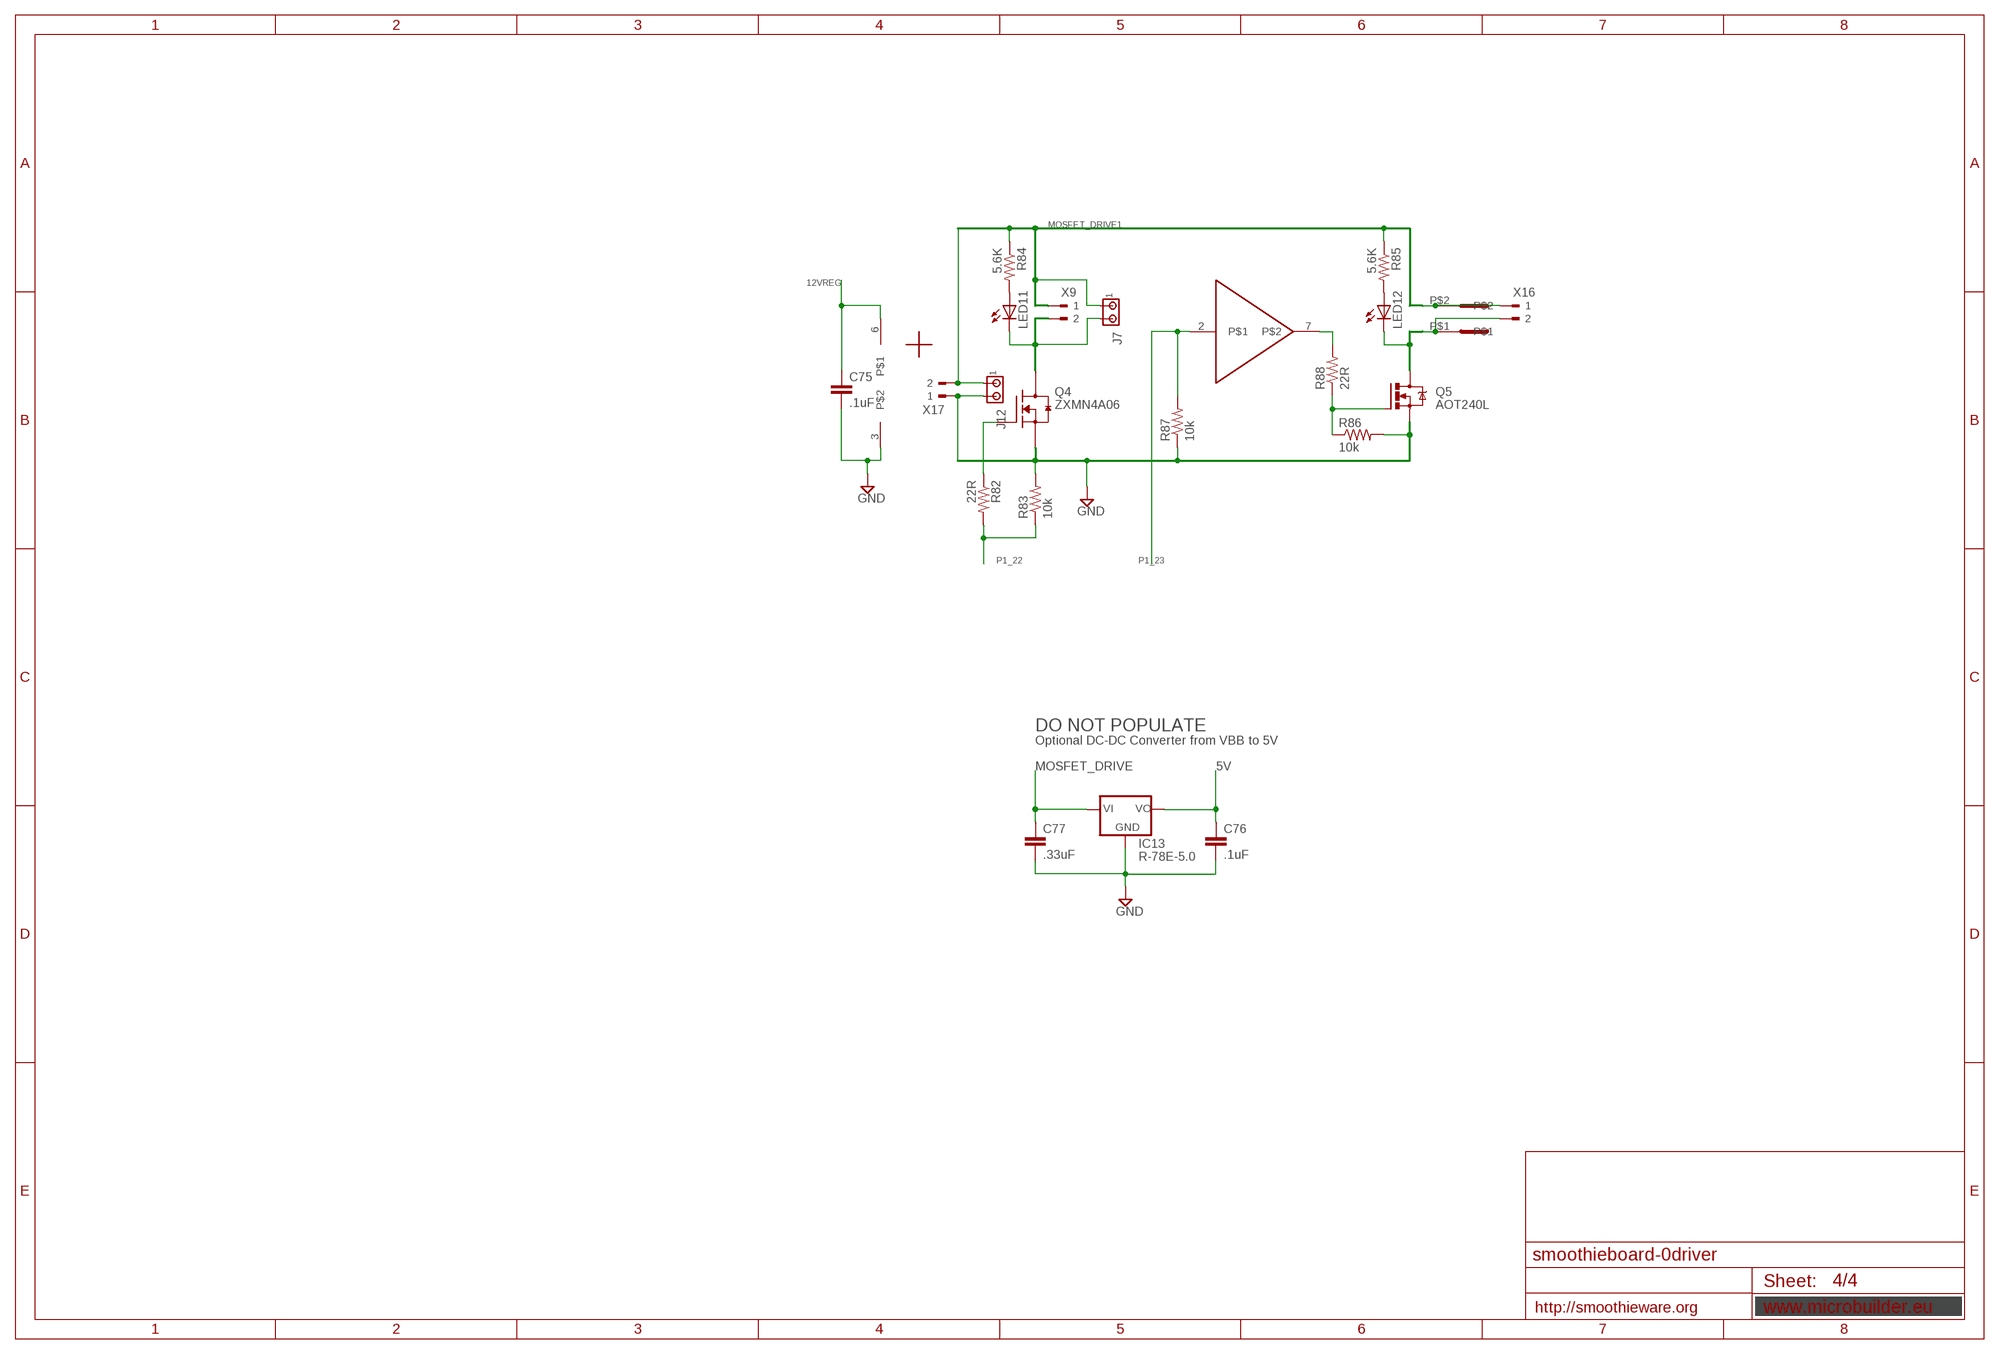
[diagram p3: schematic, sheet 4]

### Parts
C75  .1uF  C-EUC0603  [C0603]
C76  .1uF  C-EUC0603  [C0603]
C77  .33uF  C-EUC0603  [C0603]
IC13  R-78E-5.0  R-78  [R-78]
J7  MTA02-100  [10X02MTA]
J12  MTA02-100  [10X02MTA]
LED11  LEDCHIP-LED0805  [CHIP-LED0805]
LED12  LEDCHIP-LED0805  [CHIP-LED0805]
Q4  ZXMN4A06  MOSFET-NCH_SOT-223  [SOT230P700X160-4N]
Q5  AOT240L  IRF540  [TO220BV]
R82  22R  R-US_R0603  [R0603]
R83  10k  R-US_R0603  [R0603]
R84  5.6K  R-US_R0603  [R0603]
R85  5.6K  R-US_R0603  [R0603]
R86  10k  R-US_R0603  [R0603]
R87  10k  R-US_R0603  [R0603]
R88  22R  R-US_R0603  [R0603]
U$7  5MMCONN  [1715250000]
U$8  TC4427  [SOIC8]
X9  180G-2  [180G-2]
X16  180G-2  [180G-2]
X17  180G-2  [180G-2]

### Nets
5V: C76.1 IC13.3(VO) ; also sheet 1,2,3
12VREG: C75.1 U$8.6 ; also sheet 3
GND: C75.2 C76.2 C77.2 IC13.2(GND) J12.2 Q4.3(S) Q5.S R83.2 R86.2 R87.1 U$8.3 X17.1 ; also sheet 1,2,3
GPIO_FET1: Q5.G R86.1 R88.1
MOSFET_DRIVE: C77.1 IC13.1(VI) ; also sheet 1,3
MOSFET_DRIVE1: J7.1 J12.1 R84.1 R85.1 U$7.P$2 X9.1 X16.1 X17.2
N$52: J7.2 LED11.C Q4.4(D) X9.2
N$97: Q4.1(G) R82.1
N$100: LED11.A R84.2
N$109: LED12.C Q5.D U$7.P$1 X16.2
N$110: LED12.A R85.2
N$113: R88.2 U$8.7
P1_22: R82.2 R83.1 ; also sheet 1
P1_23: R87.2 U$8.2 ; also sheet 1
Unconnected: U$8.4 U$8.5

### Notes on the sheet
- DO NOT POPULATE
- Optional DC-DC Converter from VBB to 5V
- http://smoothieware.org

## Library data of the parts
C1 C44 C46 C47 C49 C51-C59 C62 C65-C67 C75 = resistor:C-EU: CAPACITOR, European symbol
C2-C6 C8-C14 C76 C77 = rcl:C-EU: CAPACITOR, European symbol
C7 C21-C24 C45 C48 C50 C60 C61 C64 = SparkFun:CAP_POL: Capacitor Polarized These are standard SMD and PTH capacitors. Normally 10uF, 47uF, and 100uF in electrolytic and tantalum varieties. Always verify the external diameter of the through hole cap, it varies with capacity, voltage, and manufacturer. The EIA devices should be standard.
D1 D2 = microbuilder:DIODE: Diode SMADIODE - SMA Surface Mount Package 20V 1A Schottky Diode Digikey (500mV @ 1A, 500uA Vr @ 20V): 641-1014-6-ND 10V 2A Schottky Diode Digikey (350mV @ 2A, 700uA Vr @ 10V): MBRA210LT3 SOD-123 30V 200mA (800mV Vf, 2uA Vr @ 25V) Schottky Diode (very fast switching for boost, etc.) - Digikey: BAT54T1GOSTR-ND 30V 500mA (430mV Vf, 130uA Vr @ 30V) Schottky Diode - Digikey: B0530W-FDICT-ND MBR120 1A 20V (0.34Vf) Schottky Diode - Digikey: MBR120VLSFT1GOSCT-ND SOD-323 10V 570mA (380mV Vf, 3ns) Schottky Diode - Digikey: ZLLS410CT-ND 1N4148WS - 75V 150mA (1V Vf @ 10mA, 4ns) Simple Diode - Digikey: 1N4148WSFSCT-ND, Mouser: 512-1N4148WS SOD-523 BAT54 30V 200mA Schottky (0.8 Vf @ 100mA, 5ns) - Digikey: BAT54XV2CT-ND 30V 30mA Schottky Diode (RB751S-40TE61) - Digikey: RB751S-40TE61CT-ND SOT23-R/W - SOT23 Package (R = Solder Paste/Reflow Ovens, W = Hand-Soldering) BAT54Film 40V 300mA - Digikey: 497-7162-1-ND DO-1N4148 Through Hole Small Current Diode (any model)
FB1 = microbuilder:FERRITE: Ferrite Bead 0603 MMZ1608B121C - 120 Ohm, 600mA Ferrite Chip - Digikey: 445-2164-1-ND BK1608HW121-T - 120 Ohm, 600mA Ferrite Chip - Digikey: 587-1876-2-ND
IC1 = microbuilder:LPC1768: LPC1768 100 MHz 32-bit ARM Cortex-M3 based microcontroller featuring a high level of integration and low power consumption. 512 kB Flash, 64 kB SRAM, USB Device/Host/OTG, Ethernet, CAN, I2S, 10-bit DAC Digikey: 568-4796-ND
IC2 = logxen:PCA9505: 40-bit I2C-bus I/O port with /RESET, /OE and /INT The 9505 has 100k ohm pull-ups on IO pins. Source: http://www.nxp.com/acrobat_download/datasheets/PCA9505_9506_3.pdf; MPN: PCA9505DGG,118; OC_FARNELL: unknown; OC_NEWARK: 70R6450
IC7 = microbuilder:74LVC1G04: 74LVC1G04 - Single Inverter Gate SOT23-5 SN74LVC1G04DBVR - Digikey: 296-11599-1-ND
IC8 = microbuilder:LAN8720: LAN8720A 10/100 Ethernet PHY Mouser: 886-LAN8720AI-CP
IC10 = SparkFun:V_REG_LM1117: Voltage Regulator LM1117 Standard adjustable voltage regulator but in SMD form. Spark Fun Electronics SKU : COM-00595
IC11 = linear:78L*: POSITOIV-VOLTAGE REGULATORS Output up to 100 mA Source: http://focus.ti.com/lit/ds/symlink/ua78l05.pdf
IC13 = logxen:R-78
J1 J6-J9 J12 = con-amp:MTA02-100: AMP connector
JP1 JP15 = SparkFun-Connectors:M03X2: Shrouded 2x3 .1" header, with keying.
JP2-JP4 JP6 JP14 JP16 JP17 JP19-JP22 JP26 = SparkFun:M03: Header 3 Standard 3-pin 0.1" header. Use with straight break away headers (SKU : PRT-00116), right angle break away headers (PRT-00553), swiss pins (PRT-00743), machine pins (PRT-00117), and female headers (PRT-00115). Molex polarized connector foot print use with SKU : PRT-08232 with associated crimp pins and housings.
JP5 = SparkFun:M06: Header 6 Standard 6-pin 0.1" header. Use with straight break away headers (SKU : PRT-00116), right angle break away headers (PRT-00553), swiss pins (PRT-00743), machine pins (PRT-00117), and female headers (PRT-00115). Molex polarized connector foot print use with SKU : PRT-08094 with associated crimp pins and housings. NOTES ON THE VARIANTS LOCK and LOCK_LONGPADS... This footprint was designed to help hold the alignment of a through-hole component (i.e. 6-pin header) while soldering it into place. You may notice that each hole has been shifted either up or down by 0.005 of an inch from it's more standard position (which is a perfectly straight line). This slight alteration caused the pins (the squares in the middle) to touch the edges of the holes. Because they are alternating, it causes a "brace" to hold the component in place. 0.005 has proven to be the perfect amount of "off-center" position when using our standard breakaway headers. Although looks a little odd when you look at the bare footprint, once you have a header in there, the alteration is very hard to notice. Also, if you push a header all the way into place, it is covered up entirely on the bottom side. This idea of altering the position of holes to aid alignment will be further integrated into the Sparkfun Library for other footprints. It can help hold any component with 3 or more connection pins.
JP7 = SparkFun-Connectors:M04: Header 4 Standard 4-pin 0.1" header. Use with straight break away headers (SKU : PRT-00116), right angle break away headers (PRT-00553), swiss pins (PRT-00743), machine pins (PRT-00117), and female headers (PRT-00115). Molex polarized connector foot print use with SKU : PRT-08231 with associated crimp pins and housings. 1MM SMD Version SKU: PRT-10208
JP9 JP11-JP13 = SparkFun-Connectors:M02: Header 2 Standard 2-pin 0.1" header. Use with straight break away headers (SKU : PRT-00116), right angle break away headers (PRT-00553), swiss pins (PRT-00743), machine pins (PRT-00117), and female headers (PRT-00115). Molex polarized connector foot print use with SKU : PRT-08233 with associated crimp pins and housings.
JP10 JP29 = SparkFun:M04: Header 4 Standard 4-pin 0.1" header. Use with straight break away headers (SKU : PRT-00116), right angle break away headers (PRT-00553), swiss pins (PRT-00743), machine pins (PRT-00117), and female headers (PRT-00115). Molex polarized connector foot print use with SKU : PRT-08231 with associated crimp pins and housings. 1MM SMD Version SKU: PRT-10208
JP23-JP25 = SparkFun:M02: Header 2 Standard 2-pin 0.1" header. Use with straight break away headers (SKU : PRT-00116), right angle break away headers (PRT-00553), swiss pins (PRT-00743), machine pins (PRT-00117), and female headers (PRT-00115). Molex polarized connector foot print use with SKU : PRT-08233 with associated crimp pins and housings.
JP32 JP33 = SparkFun:M05: Header 5 Standard 5-pin 0.1" header. Use with straight break away headers (SKU : PRT-00116), right angle break away headers (PRT-00553), swiss pins (PRT-00743), machine pins (PRT-00117), and female headers (PRT-00115). Molex polarized connector foot print use with SKU : PRT-08230 with associated crimp pins and housings.
L1 = SparkFun:INDUCTOR: Inductors Basic Inductor/Choke - 0603 and 1206. Footprints are not proven and vary greatly between part numbers.
LED1-LED12 = led:LED: LED OSRAM: - CHIPLED LG R971, LG N971, LY N971, LG Q971, LY Q971, LO R971, LY R971 LH N974, LH R974 LS Q976, LO Q976, LY Q976 LO Q996 - Hyper CHIPLED LW Q18S LB Q993, LB Q99A, LB R99A - SideLED LS A670, LO A670, LY A670, LG A670, LP A670 LB A673, LV A673, LT A673, LW A673 LH A674 LY A675 LS A676, LA A676, LO A676, LY A676, LW A676 LS A679, LY A679, LG A679 - Hyper Micro SIDELED® LS Y876, LA Y876, LO Y876, LY Y876 LT Y87S - SmartLED LW L88C, LW L88S LB L89C, LB L89S, LG L890 LS L89K, LO L89K, LY L89K LS L896, LA L896, LO L896, LY L896 - TOPLED LS T670, LO T670, LY T670, LG T670, LP T670 LSG T670, LSP T670, LSY T670, LOP T670, LYG T670 LG T671, LOG T671, LSG T671 LB T673, LV T673, LT T673, LW T673 LH T674 LS T676, LA T676, LO T676, LY T676, LB T676, LH T676, LSB T676, LW T676 LB T67C, LV T67C, LT T67C, LS T67K, LO T67K, LY T67K, LW E67C LS E67B, LA E67B, LO E67B, LY E67B, LB E67C, LV E67C, LT E67C LW T67C LS T679, LY T679, LG T679 LS T770, LO T770, LY T770, LG T770, LP T770 LB T773, LV T773, LT T773, LW T773 LH T774 LS E675, LA E675, LY E675, LS T675 LS T776, LA T776, LO T776, LY T776, LB T776 LHGB T686 LT T68C, LB T68C - Hyper Mini TOPLED® LB M676 - Mini TOPLED Santana® LG M470 LS M47K, LO M47K, LY M47K Source: http://www.osram.convergy.de LUXEON: - LUMILED® LXK2-PW12-R00, LXK2-PW12-S00, LXK2-PW14-U00, LXK2-PW14-V00 LXK2-PM12-R00, LXK2-PM12-S00, LXK2-PM14-U00 LXK2-PE12-Q00, LXK2-PE12-R00, LXK2-PE12-S00, LXK2-PE14-T00, LXK2-PE14-U00 LXK2-PB12-K00, LXK2-PB12-L00, LXK2-PB12-M00, LXK2-PB14-N00, LXK2-PB14-P00, LXK2-PB14-Q00 LXK2-PR12-L00, LXK2-PR12-M00, LXK2-PR14-Q00, LXK2-PR14-R00 LXK2-PD12-Q00, LXK2-PD12-R00, LXK2-PD12-S00 LXK2-PH12-R00, LXK2-PH12-S00 LXK2-PL12-P00, LXK2-PL12-Q00, LXK2-PL12-R00 Source: www.luxeon.com KINGBRIGHT: KA-3528ASYC Source: www.kingbright.com
M1-M6 = logxen:PAPILIO-WING-8BIT
Q1 = transistor-fet:BSL207SP: OptiMOS(R)-P Small-Signal-Transistor P-Channel, Enhancement mode, Super Logic Level (2.5 V rated) Source: http://www.infineon.com/upload/Document/BSL207SP_Rev2.01.pdf
Q2 Q3 = microbuilder:CRYSTAL: Crystals HC49UP - Surface Mount Crystal 4.0MHz 18pF +/-30ppm Surface Mount Crystal [Digikey: 535-9857-1-ND] 12.0 MHz Surface Mount Crystal [Digikey: 535-9869-6-ND] 25.0 MHz Surface Mount Crystal [Digikey: 535-9078-1-ND] 3.2 x 2.5mm - MEMs SMT Crystal 12.0 MHz 8pF 15ppm 3.2 x 2.5mm Crystal [Digikey: -10-70°C: 644-1047-1-ND -40-125°C: 644-1128-1-ND] 16.0 MHz 8pF 15ppm 3.2 x 2.5mm Crystal [Digikey: -10-70°C: 644-1049-1-ND -40-125°C: 644-1129-2-ND] 16.0 MHz 10pF 10ppm 3.2 x 2.5mm Crystal [Digikey: 644-1100-1-ND] 27.12 MHz 18pF 30ppm 3.2 x 2.5mm Crystal [Digikey: 887-1424-1-ND] 27.12MHz 10pF 10ppm 3.2 x 2.5mm Crystal [Digikey: 887-1329-1-ND] 4.9 x 1.8mm - MEMs SMT Crystal 32.768 KHz 12.5pF 20ppm 4.9 x 1.8mm Crystal [Digikey: SE2415CT-ND] Cylinder 32.768KHz Cylinder Crystal
Q4 Q8 Q9 = ipc-7351-transistor:MOSFET-NCH_
Q5-Q7 = transistor-power:IRF540: HEXFET Power MOSFET
R1-R3 R5-R17 R50-R78 R82-R88 R90 R91 = resistor:R-US_: RESISTOR, American symbol
RJ1 = Itead_BP_110825.lbr:HR911105A: SOC006
RN1 = resistor-dil:4R-N: Array Chip Resistor Source: RS Component / Phycomp; OC_FARNELL: unknown; OC_NEWARK: unknown
S1 S2 = SparkFun:TAC_SWITCH: Momentary Switch Button commonly used for reset or general input. Spark Fun Electronics SKU : COM-00097
S3 = Local Library:SWITCH-MOMENTARY-LED
SJ1 SJ2 = SparkFun:SOLDERJUMPER_2WAY: Solder Jumper 2 way solder jumper
U1 = SparkFun:USD-SOCKET: microSD Socket Push-push type uSD socket. Schematic element and footprint production proven. Spark Fun Electronics SKU : PRT-00127. tDoc lines correctly indicate media card edge positions when inserting (unlocked, locked, depressed).
U$2 U$8 = custom_esorensen:TC4427
U$5-U$7 = eric_sorensen:5MMCONN
X1-X5 X18 = con-weidmueller-sl35:180-4: WEIDMUELLER CLAMP CONNECTOR; OC_FARNELL: unknown; OC_NEWARK: unknown
X6-X10 X12 X13 X15-X17 = con-weidmueller-sl35:180G-2: WEIDMUELLER CLAMP CONNECTOR; OC_FARNELL: unknown; OC_NEWARK: unknown
X14 = SparkFun:USB: USB Connectors USB-B-PTH is fully proven SKU : PRT-00139 USB-miniB is fully proven SKU : PRT-00587 USB-A-PCB is untested. USB-A-H is throughly reviewed, but untested. Spark Fun Electronics SKU : PRT-00437 USB-B-SMT is throughly reviewed, but untested. Needs silkscreen touching up. USB-A-S has not been used/tested USB-MB-H has not been used/tested